# EAGLE design SimpleBox_20200729_oshpark (EAGLE 9.1.3)
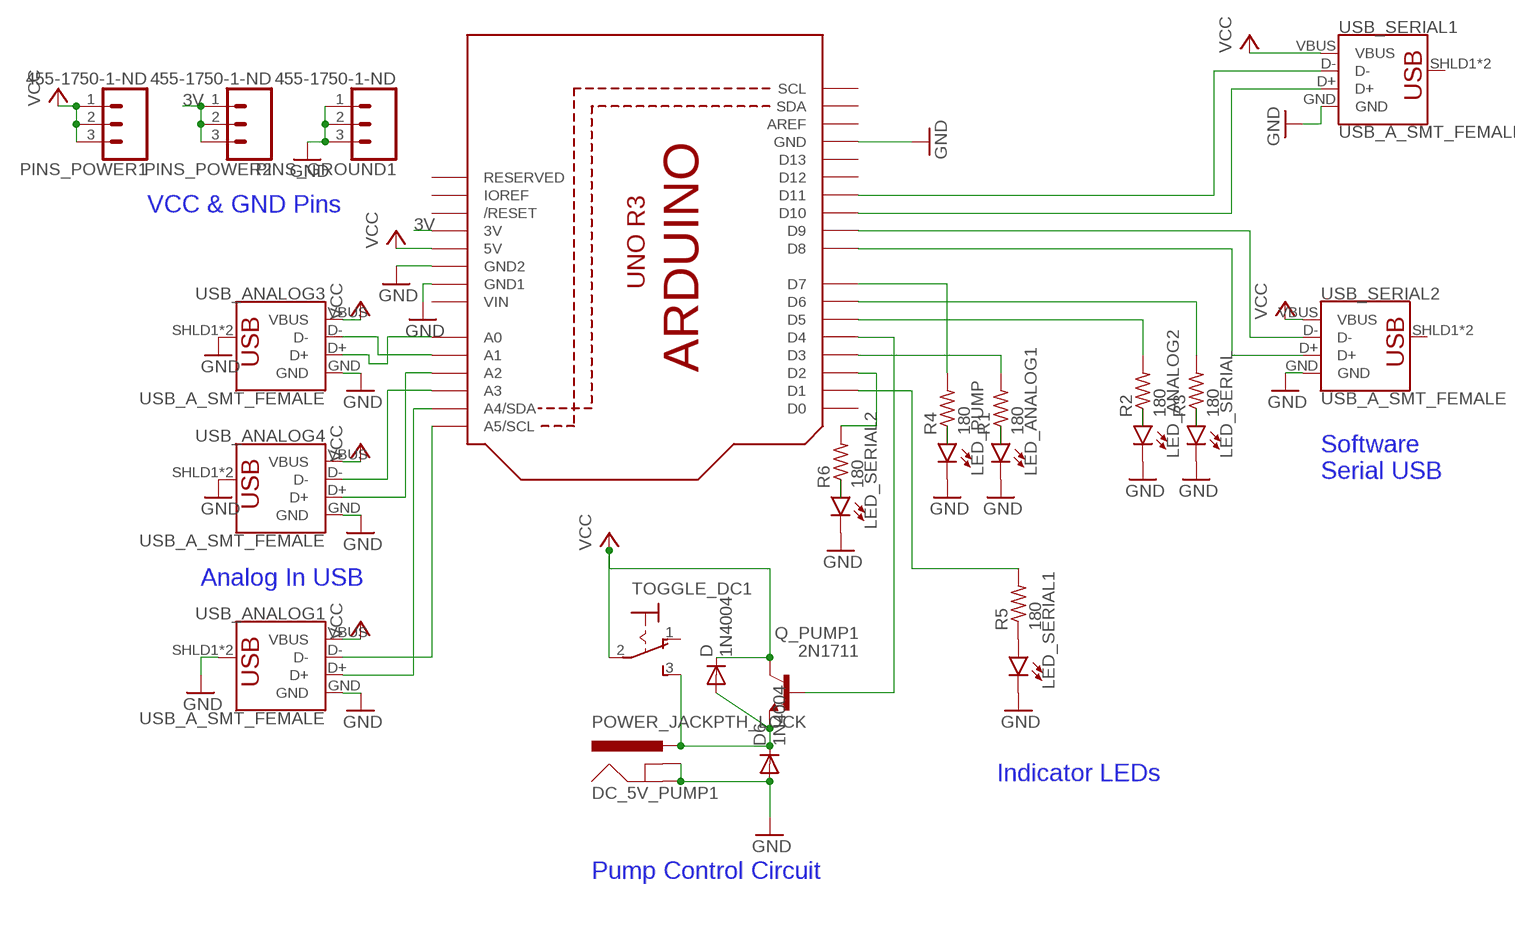
[diagram p0: schematic, sheet 1]

## Parts
D  1N4004  [DO41-10]
D6  1N4004  [DO41-10]
DC_5V_PUMP1  POWER_JACKPTH_LOCK  [POWER_JACK_PTH_LOCK]
LED_ANALOG1  LED5MM  [LED_5MM]
LED_ANALOG2  LED5MM  [LED_5MM]
LED_PUMP  LED5MM  [LED_5MM]
LED_SERIAL  LED5MM  [LED_5MM]
LED_SERIAL1  LED5MM  [LED_5MM]
LED_SERIAL2  LED5MM  [LED_5MM]
PINS_GROUND1  455-1750-1-ND  CONN_03  [1X03]
PINS_POWER1  455-1750-1-ND  CONN_03  [1X03]
PINS_POWER2  455-1750-1-ND  CONN_03  [1X03]
Q_PUMP1  2N1711  [TO39]
R1  180  R-US_0204/7  [0204/7]
R2  180  R-US_0204/7  [0204/7]
R3  180  R-US_0204/7  [0204/7]
R4  180  R-US_0204/7  [0204/7]
R5  180  R-US_0204/7  [0204/7]
R6  180  R-US_0204/7  [0204/7]
TOGGLE_DC1  M9040P  [M9040P]
U1  ARDUINOR3-BPLACE  [ARDUINOR3-BPLACE]
USB_ANALOG1  USB_A_SMT_FEMALE  [USB-A-S-SILK-FEMALE]
USB_ANALOG3  USB_A_SMT_FEMALE  [USB-A-S-SILK-FEMALE]
USB_ANALOG4  USB_A_SMT_FEMALE  [USB-A-S-SILK-FEMALE]
USB_SERIAL1  USB_A_SMT_FEMALE  [USB-A-S-SILK-FEMALE]
USB_SERIAL2  USB_A_SMT_FEMALE  [USB-A-S-SILK-FEMALE]

## Nets
3V: PINS_POWER2.1 PINS_POWER2.2 PINS_POWER2.3 U1.3V
GND: D6.A DC_5V_PUMP1.GND DC_5V_PUMP1.GNDBREAK LED_ANALOG1.K(C) LED_ANALOG2.K(C) LED_PUMP.K(C) LED_SERIAL1.K(C) LED_SERIAL2.K(C) LED_SERIAL.K(C) PINS_GROUND1.1 PINS_GROUND1.2 PINS_GROUND1.3 U1.GND U1.GND1 U1.GND2 USB_ANALOG1.GND USB_ANALOG1.SHLD1(SHIELD) USB_ANALOG1.SHLD2(SHIELD) USB_ANALOG3.GND USB_ANALOG3.SHLD1(SHIELD) USB_ANALOG3.SHLD2(SHIELD) USB_ANALOG4.GND USB_ANALOG4.SHLD1(SHIELD) USB_ANALOG4.SHLD2(SHIELD) USB_SERIAL1.GND USB_SERIAL2.GND
N$1: LED_ANALOG1.A R1.1
N$2: LED_ANALOG2.A R2.1
N$3: LED_SERIAL.A R3.1
N$4: LED_PUMP.A R4.1
N$5: U1.A3 USB_ANALOG4.D-
N$6: U1.A2 USB_ANALOG4.D+
N$7: U1.A1 USB_ANALOG3.D-
N$8: U1.A0 USB_ANALOG3.D+
N$9: U1.D8 USB_SERIAL2.D+
N$10: U1.D9 USB_SERIAL2.D-
N$11: Q_PUMP1.2(B) U1.D4
N$12: U1.D11 USB_SERIAL1.D-
N$13: U1.D10 USB_SERIAL1.D+
N$14: LED_SERIAL1.A R5.1
N$15: R4.2 U1.D7
N$16: LED_SERIAL2.A R6.1
N$17: R5.2 U1.D1
N$18: U1.A5(A5/SCL) USB_ANALOG1.D-
N$19: R3.2 U1.D6
N$20: R6.2 U1.D2
N$21: R1.2 U1.D3
N$22: U1.A4(A4/SDA) USB_ANALOG1.D+
N$26: R2.2 U1.D5
N$32: D6.C D.A DC_5V_PUMP1.PWR Q_PUMP1.1(E) TOGGLE_DC1.3(S)
VCC: D.C PINS_POWER1.1 PINS_POWER1.2 PINS_POWER1.3 Q_PUMP1.3(C) TOGGLE_DC1.2(P) U1.5V USB_ANALOG1.VBUS USB_ANALOG3.VBUS USB_ANALOG4.VBUS USB_SERIAL1.VBUS USB_SERIAL2.VBUS
Unconnected: TOGGLE_DC1.1(O) U1.AREF U1.D0 U1.D12 U1.D13 U1.IOREF U1.RESERVED U1.RESET(/RESET) U1.SCL U1.SDA USB_SERIAL1.SHLD1(SHIELD) USB_SERIAL1.SHLD2(SHIELD) USB_SERIAL2.SHLD1(SHIELD) USB_SERIAL2.SHLD2(SHIELD)

## Notes on the sheet
- VCC & GND Pins
- Software 
  Serial USB
- Analog In USB
- Indicator LEDs
- Pump Control Circuit

## Power pins joined to a net without a drawn wire
VIN: U1.VIN

## Library data of the parts
D D6 = adafruit:1N4004: DIODE General purpose 1N400x type rectifier (With bigger pads) http://www.ladyada.net/library/pcb/eaglelibrary.html
DC_5V_PUMP1 = SparkFun-Connectors:POWER_JACK: Power Jack Connector This is the standard 5.5mm barrel jack for power. The PTH is the most common, proven, reliable, footprint. The Slot footprint only works if the mill layer is transmitted to the PCB fab house so be warned. Here are the connectors we sell at SparkFun: DC Barrel Power Jack/Connector <https://www.sparkfun.com/products/119> (PRT-00119) DC Barrel Power Jack/Connector (SMD) <https://www.sparkfun.com/products/12748> (PRT-12748) DC Barrel Jack Adapter - Breadboard Compatible <https://www.sparkfun.com/products/10811> (PRT-10811) It is used on this SparkFun product (and many, many others): SparkFun RedBoard - Programmed with Arduino <https://www.sparkfun.com/products/12757> (DEV-12757) Also, if you need a mating power supply or connector, please check these out: Wall Adapter Power Supply - 9VDC 650mA <https://www.sparkfun.com/products/298> (TOL-00298) DC Barrel Jack Adapter - Male <https://www.sparkfun.com/products/10287> (PRT-10287); PROD_ID: CONN-08197; SF_ID: PRT-00119; SPICEPREFIX: J
LED_ANALOG1 LED_ANALOG2 LED_PUMP LED_SERIAL LED_SERIAL1 LED_SERIAL2 = SparkFun-LED:LED: LED (Generic) Standard schematic elements and footprints for 5mm, 3mm, 1206, and 0603 sized LEDs. Generic LEDs with no color specified.
PINS_GROUND1 PINS_POWER1 PINS_POWER2 = SparkFun-Connectors:CONN_03: Multi connection point. Often used as Generic Header-pin footprint for 0.1 inch spaced/style header connections On any of the 0.1 inch spaced packages, you can populate with these: Break Away Headers - Straight <https://www.sparkfun.com/products/116> (PRT-00116) Break Away Male Headers - Right Angle <https://www.sparkfun.com/products/553> (PRT-00553) Female Headers <https://www.sparkfun.com/products/115> (PRT-00115) Break Away Headers - Machine Pin <https://www.sparkfun.com/products/117> (PRT-00117) Break Away Female Headers - Swiss Machine Pin <https://www.sparkfun.com/products/743> (PRT-00743) Stackable Header - 3 Pin (Female, 0.1") <https://www.sparkfun.com/products/13875> (PRT-13875) For SCREWTERMINALS and SPRING TERMINALS visit here: Screw Terimnals on SparkFun.com <https://www.sparkfun.com/search/results?term=Screw+Terminals> (5mm/3.5mm/2.54mm spacing) This device is also useful as a general connection point to wire up your design to another part of your project. Our various solder wires solder well into these plated through hole pads. Hook-Up Wire - Assortment (Stranded, 22 AWG) <https://www.sparkfun.com/products/11375> (PRT-11375) Hook-Up Wire - Assortment (Solid Core, 22 AWG) <https://www.sparkfun.com/products/11367> (PRT-11367) View the entire wire category on our website here <https://www.sparkfun.com/categories/141> Special notes: Molex polarized connector foot print use with SKU : PRT-08232 with associated crimp pins and housings.; PROD_ID: XXX-00000
Q_PUMP1 = transistor-npn:2N1711: NPN Transistor
R1-R6 = rcl:R-US_: RESISTOR, American symbol; SPICEPREFIX: R
TOGGLE_DC1 = switch:M9040P: TOGGLE SWITCH Marquardt
U1 = adafruit:ARDUINOR3: This is a new object for the new Arduino R3 - with extra pins that you may want to use (such as IOref, and duplicated A4/A5
USB_ANALOG1 USB_ANALOG3 USB_ANALOG4 USB_SERIAL1 USB_SERIAL2 = SparkFun-Connectors:USB_A: USB-A Connector Male and female variants, as well as PTH and SMT variants SparkFun Products: SparkFun XBee Explorer Dongle <https://www.sparkfun.com/products/11697> PTH Male SparkFun MicroView-USB Programmer <https://www.sparkfun.com/products/12924> SMT Male SparkFun USB Type A Female Breakout <https://www.sparkfun.com/products/12700> SMT Female; PROD_ID: CONN-09520; SF_ID: PRT-09011

## Board
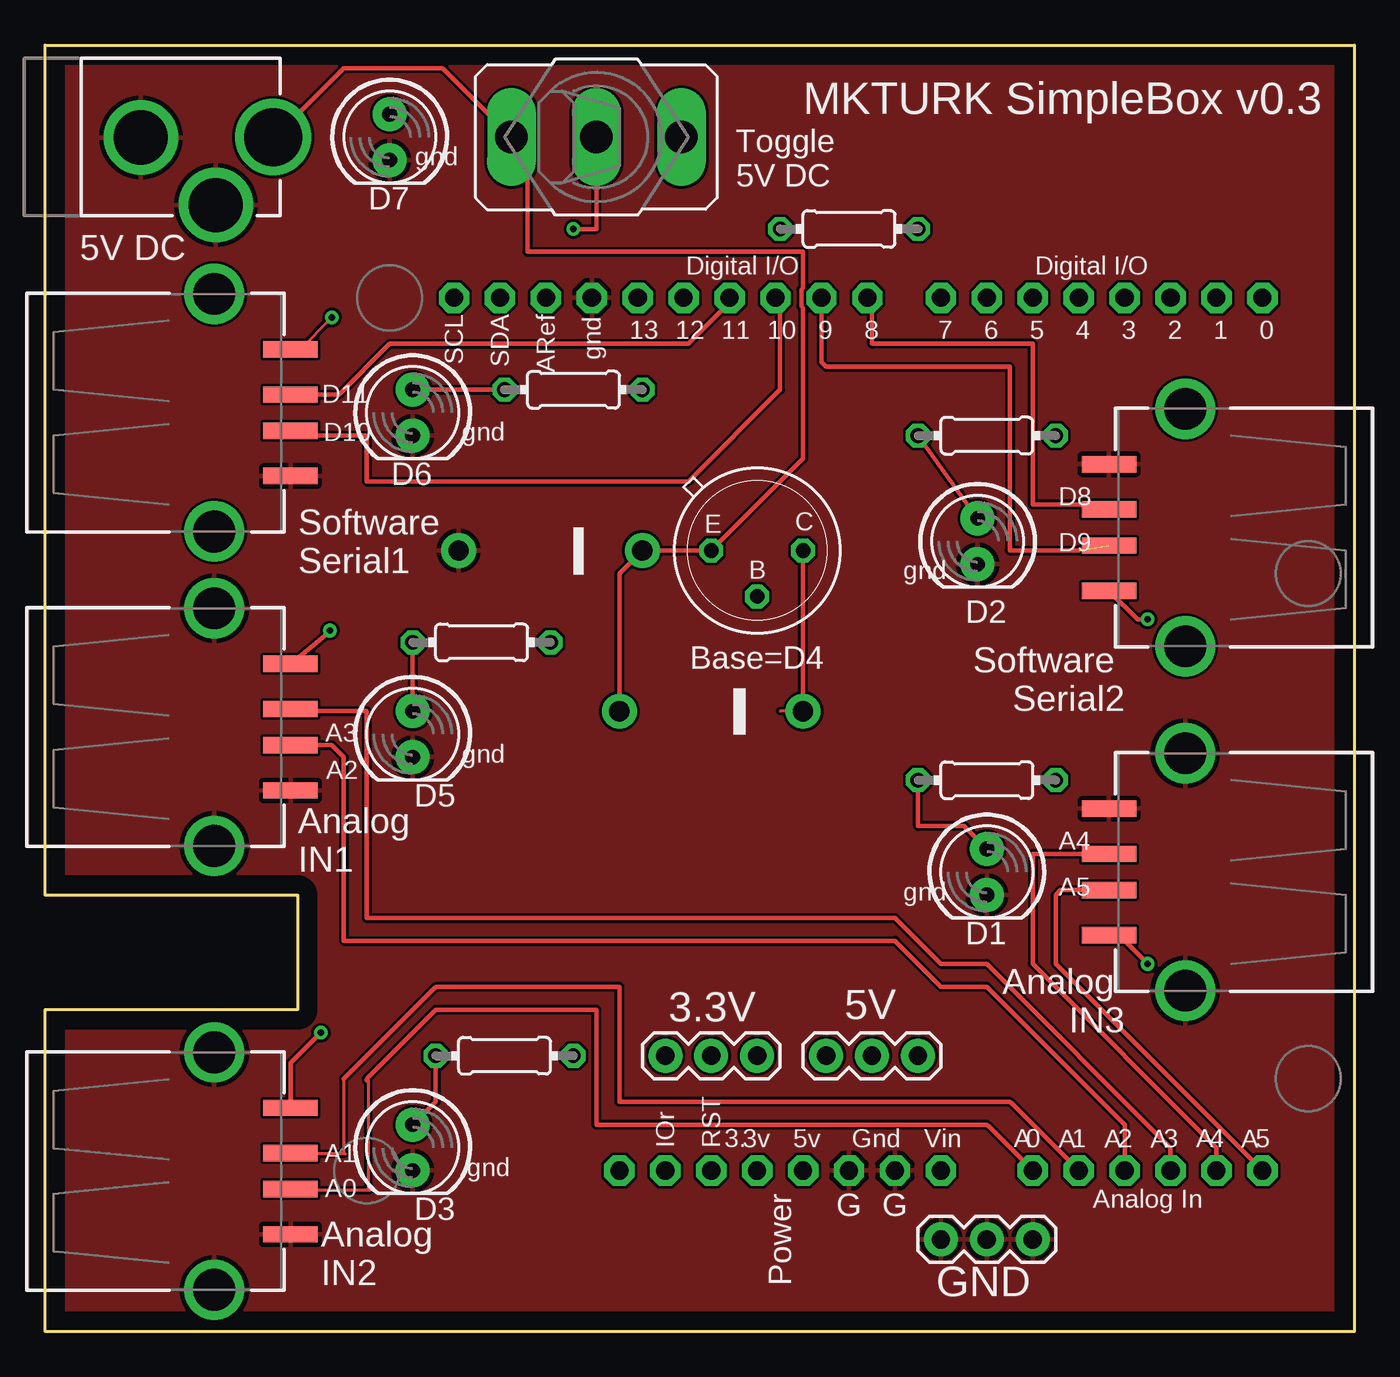
[diagram p1: board, top side]
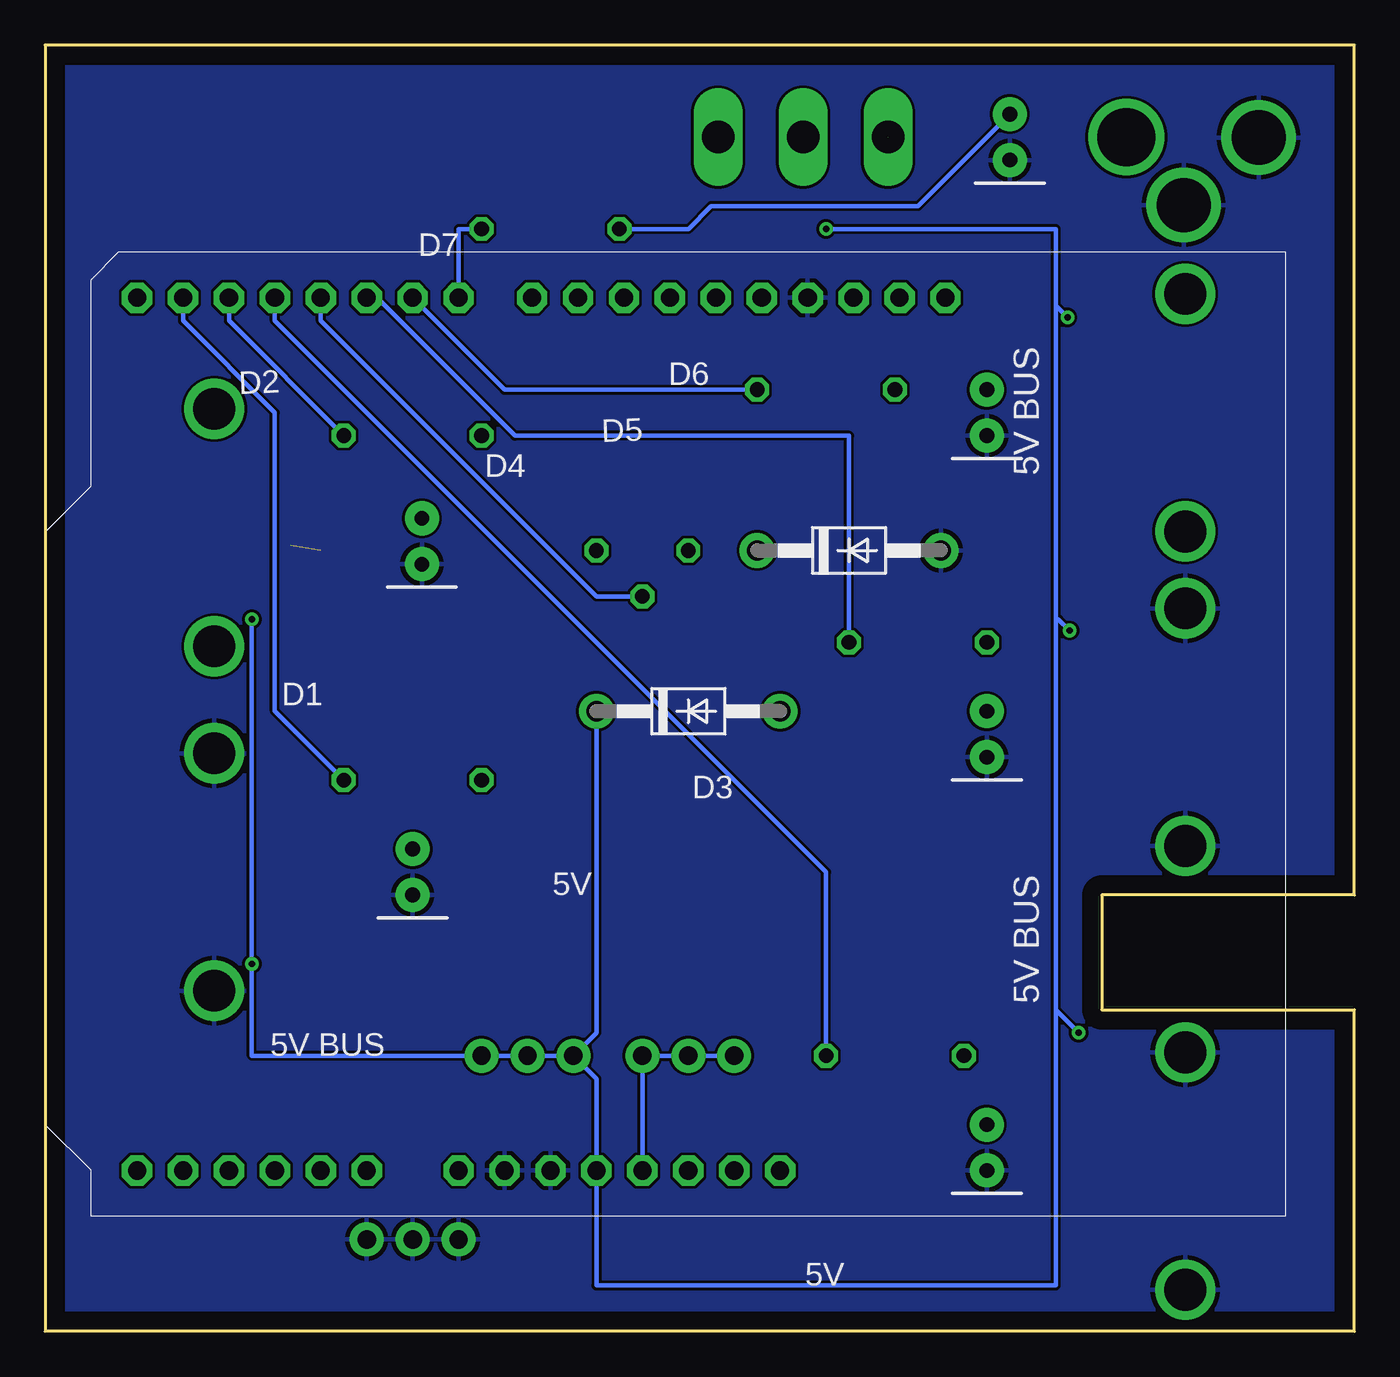
[diagram p2: board, bottom side, seen from below]

Size 72.39 x 71.12 mm. Coordinates in mm from the lower left corner, seen from the top.
Outline: 0,0 72.39,0 72.39,71.12 0,71.12 0,24.13 13.97,24.13 13.97,17.78 0,17.78 0,0
Copper layers (1*16): Top 0.035mm / dielectric 1.5mm / Bottom 0.035mm
Design rules "default": minimum track width 6mil, minimum drill 0.35mm, track to track 6mil, track to pad 6mil, pad to pad 6mil, via to via 6mil, smd to smd 6mil, copper to edge 40mil, drill to drill 6mil, minimum pad ring 10mil, minimum via ring 8mil, stop-mask expansion 4mil, vias tented up to drill 0mil, thermal gap 10mil

### Footprints (pad centres in the part's own frame; a part is rotated, then mirrored left to right if it is on the bottom)
DO41-10 = drill 1.118 pad 1.93: A 5.08,0; C -5.08,0
POWER_JACK_PTH_LOCK = drill 2.997 pad 4.115: GND 0.025,6.557; GNDBREAK 3.762,10.7 | drill 3.2 pad 4.115: PWR 0,13.878
LED_5MM = drill 0.813 pad 1.88: A -1.27,0; K 1.27,0
1X03 = drill 1.016 pad 1.88: 1 0,0; 2 2.54,0; 3 5.08,0
TO39 = drill 0.813 octagon: 1 0,-2.54; 2 2.54,0; 3 0,2.54
0204/7 = drill 0.813 octagon: 1 -3.81,0; 2 3.81,0
M9040P = drill 1.803 long: 1 0,4.699; 2 0,0; 3 0,-4.699
ARDUINOR3-BPLACE = drill 1 pad 1.676 octagon: 3V 35.56,2.54; 5V 38.1,2.54; A0 50.8,2.54; A1 53.34,2.54; A2 55.88,2.54; A3 58.42,2.54; A4 60.96,2.54; A5 63.5,2.54; AREF 23.876,50.8; D0 63.5,50.8; D1 60.96,50.8; D2 58.42,50.8; D3 55.88,50.8; D4 53.34,50.8; D5 50.8,50.8; D6 48.26,50.8; D7 45.72,50.8; D8 41.656,50.8; D9 39.116,50.8; D10 36.576,50.8; D11 34.036,50.8; D12 31.496,50.8; D13 28.956,50.8; GND 26.416,50.8; GND1 43.18,2.54; GND2 40.64,2.54; IOREF 30.48,2.54; RESERVED 27.94,2.54; RESET 33.02,2.54; SCL 18.796,50.8; SDA 21.336,50.8; VIN 45.72,2.54
USB-A-S-SILK-FEMALE = smd 3 x 0.9: D+ 7.212,-1; D- 7.212,1; GND 7.212,-3.5; VBUS 7.212,3.5 | drill 2.311: SHLD1 3,-6.566; SHLD2 3,6.566

### Placement (x,y rotation side)
D  36.83,34.29 0 bottom
D6  27.94,43.18 0 bottom
DC_5V_PUMP1  -1.27,66.04 270 top
LED_ANALOG1  20.32,10.16 270 top
LED_ANALOG2  20.32,33.02 270 top
LED_PUMP  19.05,66.04 270 top
LED_SERIAL  20.32,50.8 270 top
LED_SERIAL1  52.07,25.4 270 top
LED_SERIAL2  51.56,43.69 270 top
PINS_GROUND1  49.53,5.08 0 top
PINS_POWER1  43.18,15.24 0 top
PINS_POWER2  34.29,15.24 0 top
Q_PUMP1  39.37,43.18 270 top
R1  25.4,15.24 0 top
R2  24.13,38.1 0 top
R3  29.21,52.07 0 top
R4  44.45,60.96 0 top
R5  52.07,30.48 0 top
R6  52.07,49.53 0 top
TOGGLE_DC1  30.48,66.04 270 top
U1  3.81,6.35 0 top
USB_ANALOG1  66.04,25.4 180 top
USB_ANALOG3  6.35,8.86 0 top
USB_ANALOG4  6.35,33.41 0 top
USB_SERIAL1  6.35,50.8 0 top
USB_SERIAL2  66.04,44.45 180 top

### Tracks (layer width: path | path; a pad name or v marks a point on that pad's centre or on a via)
3V
  Bottom 0.254: 39.44,9.07 arc-45 U1.3V PINS_POWER2.3 PINS_POWER2.2 PINS_POWER2.1
GND
  pour Top: 0,71.12 0,24.13 13.97,24.13 13.97,17.78 0,17.78 0,0 72.39,0 72.39,71.12
  pour Bottom: 0,71.12 72.39,71.12 72.39,0 0,0 0,17.78 13.97,17.78 13.97,24.13 0,24.13
N$1
  Top 0.254: R1.1 21.59,12.7 LED_ANALOG1.A
N$2
  Top 0.254: R2.1 LED_ANALOG2.A
N$3
  Top 0.254: LED_SERIAL.A R3.1
N$4
  Bottom 0.254: LED_PUMP.A 24.13,62.23 35.56,62.23 36.83,60.96 R4.1
N$5
  Top 0.152: 13.69,34.29 USB_ANALOG4.D-
  Top 0.254: USB_ANALOG4.D- 13.69,34.29 17.78,34.29 17.78,22.86 46.99,22.86 49.53,20.32 52.07,20.32 62.23,10.16 U1.A3
N$6
  Top 0.152: 13.64,32.33 USB_ANALOG4.D+
  Top 0.254: USB_ANALOG4.D+ 15.85,32.41 16.51,31.75 16.51,21.59 46.99,21.59 49.53,19.05 52.07,19.05 59.69,11.43 U1.A2
N$7
  Top 0.152: USB_ANALOG3.D- 13.62,9.8 16.59,9.8 16.51,9.88 16.51,13.97
  Top 0.254: 16.51,13.97 21.52,18.98 arc-45 21.7,19.05 31.75,19.05 31.75,12.7 53.23,12.7 arc-45 53.41,12.63 U1.A1
N$8
  Top 0.152: 17.76,13.95 17.85,14.04 17.85,7.88 17.94,7.79 13.63,7.79 USB_ANALOG3.D+
  Top 0.254: 17.78,13.87 arc-45 17.85,14.04 21.59,17.78 30.48,17.78 30.48,11.43 51.97,11.43 arc-45 52.14,11.36 U1.A0
N$9
  Top 0.254: USB_SERIAL2.D+ 58.56,45.72 54.61,45.72 54.61,54.61 45.72,54.61 45.72,56.9 U1.D8
N$10  (1 unrouted)
  Top 0.254: U1.D9 42.93,53.59 43.18,53.34 53.34,53.34 53.34,43.18 57.15,43.18
N$11
  Bottom 0.254: U1.D4 57.15,55.88 41.91,40.64 Q_PUMP1.2
N$12
  Top 0.152: USB_SERIAL1.D- 13.83,52.07
  Top 0.254: 13.7,51.8 USB_SERIAL1.D- 16.24,51.8 19.05,54.61 35.56,54.61 37.85,56.9 U1.D11
N$13
  Top 0.254: 14.24,49.8 USB_SERIAL1.D+ 13.83,49.53 17.78,49.53 17.78,46.99 35.56,46.99 40.64,52.07 40.64,57.15 U1.D10
N$14
  Top 0.254: LED_SERIAL1.A 50.8,27.94 48.26,27.94 R5.1
N$15
  Bottom 0.254: R4.2 49.53,60.96 U1.D7
N$16
  Top 0.254: LED_SERIAL2.A R6.1
N$17
  Bottom 0.254: U1.D1 64.77,55.88 59.69,50.8 59.69,34.29 R5.2
N$18
  Top 0.254: U1.A5 55.88,20.32 55.88,24.13 56.15,24.4 USB_ANALOG1.D-
N$19
  Bottom 0.254: U1.D6 46.99,52.07 R3.2
N$20
  Bottom 0.254: R6.2 62.23,55.88 U1.D2
N$21
  Bottom 0.254: R1.2 29.21,25.4 52.07,48.26 59.69,55.88 U1.D3
N$22
  Top 0.254: USB_ANALOG1.D+ 54.61,26.4 54.61,20.32 64.77,10.16 U1.A4
N$26
  Bottom 0.254: R2.2 27.94,49.53 46.41,49.53 54.04,57.15 U1.D5
N$32  (1 unrouted)
  Top 0.254: 22.05,69.78 arc45 21.87,69.85 | 22.05,69.78 arc45 21.87,69.85 | 21.87,69.85 16.51,69.85 12.77,66.11 arc-45 DC_5V_PUMP1.PWR | 22.05,69.78 TOGGLE_DC1.3 26.67,65.15 26.67,59.69 41.91,59.69 41.91,57.71 41.81,57.61 41.81,56.69 41.91,56.58 41.91,48.26 Q_PUMP1.1 D6.C 31.75,41.91 D.A
VCC  (via drill 0.35)
  Top 0.152: D.C 40.64,34.29 | USB_SERIAL1.VBUS 14.09,54.3 v15.86,56.07
  Top 0.254: v29.21,60.96 30.48,60.96 TOGGLE_DC1.2 | USB_ANALOG4.VBUS 15.66,38.61 arc-45 15.84,38.69 15.89,38.69 | 15.92,38.69 15.89,38.69 | 15.89,38.69 arc-45 v15.74,38.75 | D.C Q_PUMP1.3 | USB_ANALOG3.VBUS 13.56,14.83 v15.24,16.51 | USB_ANALOG1.VBUS 58.83,21.59 59.69,21.59 v60.96,20.32 | USB_SERIAL2.VBUS 60.41,39.37 v60.96,39.37
  Bottom 0.254: 16.07,56.08 arc-45 15.89,56.01 15.8,56.01 v15.86,56.07 | v15.86,56.07 arc45 v15.86,56.07 | PINS_POWER1.1 41.91,13.97 U1.5V 41.91,2.54 16.51,2.54 16.51,17.78 | PINS_POWER1.1 PINS_POWER1.2 PINS_POWER1.3 60.96,15.24 v60.96,20.32 v60.96,39.37 | v29.21,60.96 16.51,60.96 16.51,56.72 | 16.51,39.37 16.51,56.72 | v15.86,56.07 16.51,56.72 | v15.74,38.75 16.36,39.37 16.51,39.37 | 16.51,17.78 16.51,39.37 | v15.24,16.51 16.51,17.78 | PINS_POWER1.1 41.91,16.51 D.C

### Text on the board
tPlace: MKTURK SimpleBox v0.3 | gnd | Toggle / 5V DC | D7 | 5V DC | D11 | gnd | D10 | D6 | D8 | C | E | D9 | Software / Serial1 | B | gnd | D2 | Base=D4 | Software / Serial2 | A3 | gnd | A2 | D5 | A4 | Analog / IN1 | A5 | gnd | D1 | 5V | 3.3V | Analog / IN3 | A1 | 3. | A | A | A | A | A | A | gnd | A0 | G | G | D3 | Power | Analog / IN2 | GND
bPlace: D7 | D6 | D2 | D5 | 5V BUS | D4 | D1 | D3 | 5V | 5V BUS | 5V BUS | 5V